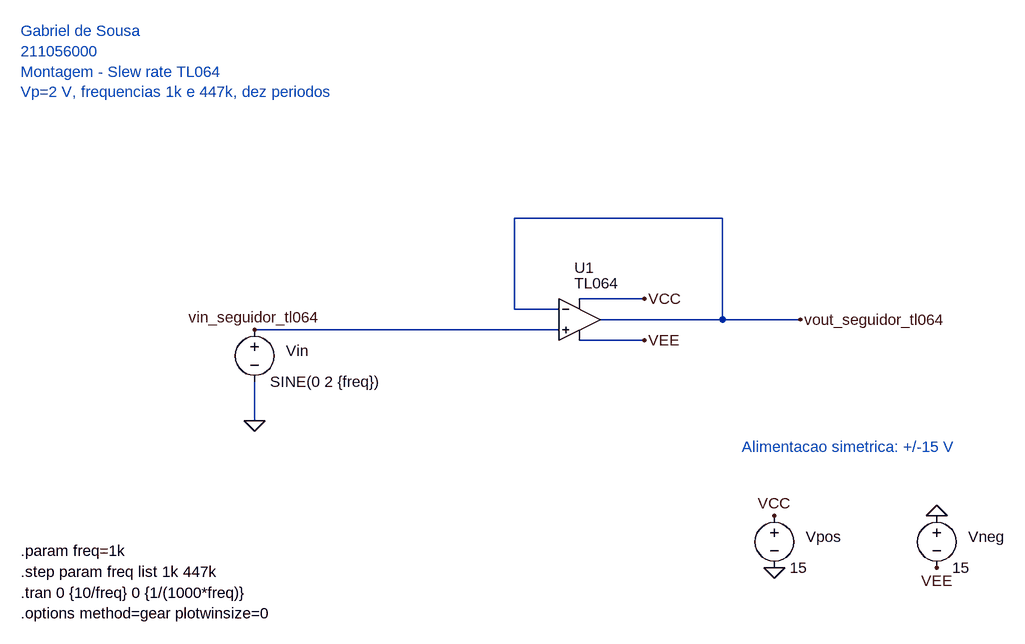
[diagram p0: schematic montagem_slew_tl064.asc]
montagem_slew_tl064.asc, the LTspice schematic file:
Version 4.1
SHEET 1 1600 900
TEXT 40 -80 Left 2 ;Gabriel de Sousa\n211056000\nMontagem - Slew rate TL064\nVp=2 V, frequencias 1k e 447k, dez periodos
SYMBOL TL064 900 300 R0
WINDOW 0 -8 -16 Left 2
WINDOW 3 -8 8 Left 2
SYMATTR InstName U1
WIRE 900 332 1000 332
FLAG 1000 332 VCC
WIRE 900 396 1000 396
FLAG 1000 396 VEE
WIRE 932 364 1240 364
WIRE 1120 364 1120 208
WIRE 1120 208 800 208
WIRE 800 208 800 348
WIRE 800 348 868 348
WIRE 400 380 868 380
WIRE 400 460 400 520
SYMBOL voltage 400 364 R0
WINDOW 0 48 48 Left 2
SYMATTR InstName Vin
SYMATTR Value SINE(0 2 {freq})
FLAG 400 380 vin_seguidor_tl064
FLAG 400 520 0
FLAG 1240 364 vout_seguidor_tl064
TEXT 1150 560 Left 2 ;Alimentacao simetrica: +/-15 V
SYMBOL voltage 1200 650 R0
WINDOW 0 48 48 Left 2
SYMATTR InstName Vpos
SYMATTR Value 15
SYMBOL voltage 1450 650 R0
WINDOW 0 48 48 Left 2
SYMATTR InstName Vneg
SYMATTR Value 15
FLAG 1200 666 VCC
FLAG 1200 746 0
FLAG 1450 666 0
FLAG 1450 746 VEE
TEXT 40 720 Left 2 !.param freq=1k
TEXT 40 752 Left 2 !.step param freq list 1k 447k
TEXT 40 784 Left 2 !.tran 0 {10/freq} 0 {1/(1000*freq)}
TEXT 40 816 Left 2 !.options method=gear plotwinsize=0

The netlist it stands for:
* montagem_slew_tl064.asc
* U1: TL064 (symbol TL064 not available, pins judged from their places): In+=vin_seguidor_tl064 In-=vout_seguidor_tl064 V+=VCC V-=VEE OUT=vout_seguidor_tl064
Vin vin_seguidor_tl064 0 SINE(0 2 {freq})
Vpos VCC 0 15
Vneg 0 VEE 15
* Gabriel de Sousa
* 211056000
* Montagem - Slew rate TL064
* Vp=2 V, frequencias 1k e 447k, dez periodos
* Alimentacao simetrica: +/-15 V
.param freq=1k
.step param freq list 1k 447k
.tran 0 {10/freq} 0 {1/(1000*freq)}
.options method=gear plotwinsize=0
.backanno
.end